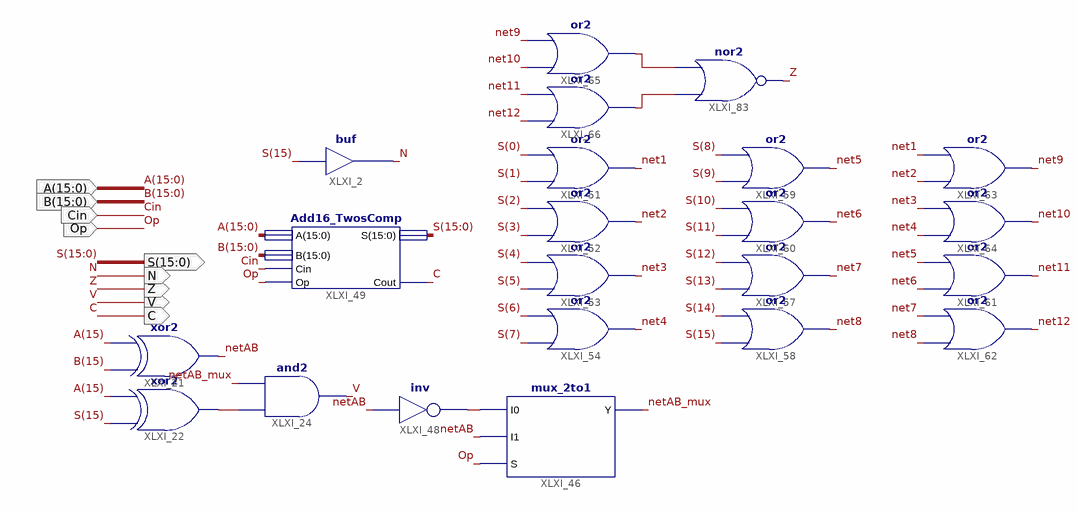
[diagram p0: schematic sheet 1]
// Xilinx ISE schematic ALU_16bit.sch (virtex6) as structural Verilog: 22 symbols, 9 ports
module ALU_16bit (
  input  [15:0] A,
  input  [15:0] B,
  input  Op,
  input  Cin,
  output Z,
  output N,
  output [15:0] S,
  output C,
  output V
);

  wire net1, net2, net3, net4, net5, net6, net7, net8, net9, net10, net11, net12, netAB, netAB_mux, XLXN_27,
       XLXN_119, XLXN_218, XLXN_219;

  and XLXI_24 (V, XLXN_27, netAB_mux);
  xor XLXI_22 (XLXN_27, S[15], A[15]);
  mux_2to1 XLXI_46 (.I0(XLXN_119), .I1(netAB), .S(Op), .Y(netAB_mux));
  not XLXI_48 (XLXN_119, netAB);
  xor XLXI_21 (netAB, B[15], A[15]);
  Add16_TwosComp XLXI_49 (.Op(Op), .Cin(Cin), .A(A), .B(B), .S(S), .Cout(C));
  or XLXI_53 (net3, S[5], S[4]);
  or XLXI_54 (net4, S[7], S[6]);
  or XLXI_51 (net1, S[1], S[0]);
  or XLXI_52 (net2, S[3], S[2]);
  or XLXI_57 (net7, S[13], S[12]);
  or XLXI_58 (net8, S[15], S[14]);
  or XLXI_59 (net5, S[9], S[8]);
  or XLXI_60 (net6, S[11], S[10]);
  or XLXI_61 (net11, net6, net5);
  or XLXI_62 (net12, net8, net7);
  or XLXI_63 (net9, net2, net1);
  or XLXI_64 (net10, net4, net3);
  or XLXI_65 (XLXN_218, net10, net9);
  or XLXI_66 (XLXN_219, net12, net11);
  nor XLXI_83 (Z, XLXN_219, XLXN_218);
  buf XLXI_2 (N, S[15]);
endmodule
